# Altium schematic sheet stm32f103.SchDoc
size 381 x 203 mm; SheetNumber: 4; SheetTotal: 4
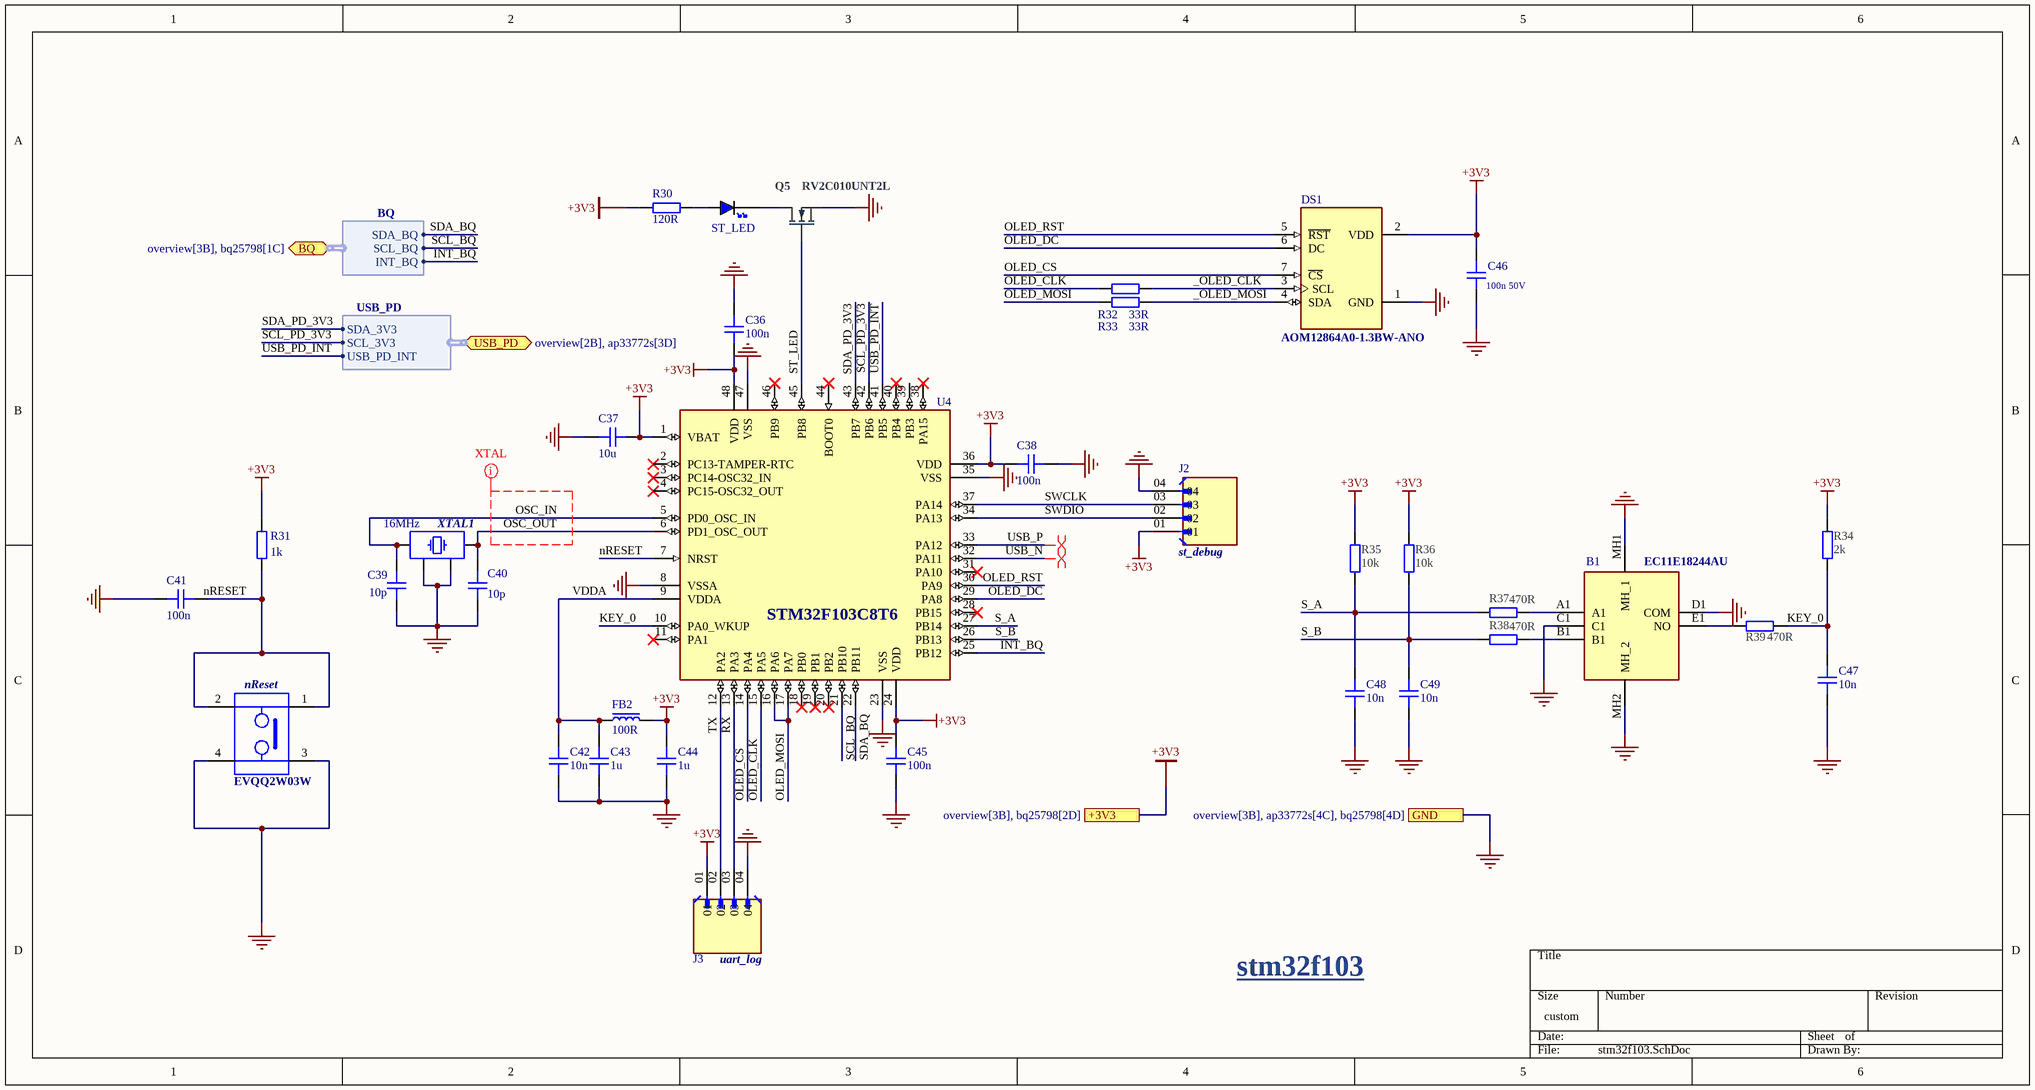
[diagram p0: stm32f103.SchDoc]

## Parts
B1  EC11E18244AU  [EC11E18244AU]
C36  100n  [CAP_0402]
C37  10u  [CAP_0402]
C38  100n  [CAP_0402]
C39  10p  [CAP_0402]
C40  10p  [CAP_0402]
C41  100n  [CAP_0603]
C42  10n  [CAP_0603]
C43  1u  [CAP_0603]
C44  1u  [CAP_0603]
C45  100n  [CAP_0402]
C46  100n 50V  [CAP_0603]
C47  10n  [CAP_0402]
C48  10n  [CAP_0402]
C49  10n  [CAP_0402]
DS1  AOM12864A0-1.3BW-ANO  [LCD_AOM12864A0-1.3BW-ANO]
FB2  100R  [FB_0603]
J2  st_debug  [SAMTEC_TSW-104-08-T-S-LL]
J3  uart_log  [SAMTEC_TSW-104-08-T-S-LL]
nReset  EVQQ2W03W  [EVQQ2W03W]
Q5  RV2C010UNT2L  [DFN65P100X40-3L]
R30  120R  [RES_0603]
R31  1k  [RES_0603]
R32  33R  [RES_0603]
R33  33R  [RES_0603]
R34  2k  [RESC1005X04L]
R35  10k  [RESC1005X04L]
R36  10k  [RESC1005X04L]
R37  470R  [RESC1005X04L]
R38  470R  [RESC1005X04L]
R39  470R  [RESC1005X04L]
ST_LED  BLUE  [LED_0603_BLUE]  (value not drawn)
U4  STM32F103C8T6  [QFP50P900X900X160-48N]
XTAL1  16MHz  [XTAL_2520]

## Ports
+3V3 (see overview[3B], bq25798[2D]), BQ (bidir, harness BQ, see overview[3B], bq25798[1C]), GND (see overview[3B], ap33772s[4C], bq25798[4D]), USB_PD (bidir, harness USB_PD, see overview[2B], ap33772s[3D])

## Harnesses
USB_PD: SCL_3V3, SDA_3V3, USB_PD_INT
BQ: SDA_BQ, SCL_BQ, INT_BQ

## Nets
+3V3: C36.2 C37.2 C38.1 C44.2 C45.2 C46.2 DS1.2(VDD) FB2.2 J2.01 J3.01 R30.2 R31.1 R34.2 R35.2 R36.2 U4.1(VBAT) U4.24(VDD) U4.36(VDD) U4.48(VDD) ; port +3V3
GND: B1.C1 B1.D1(COM) B1.MH1(MH_1) B1.MH2(MH_2) C36.1 C37.1 C38.2 C39.1 C40.1 C41.1 C42.1 C43.1 C44.1 C45.1 C46.1 C47.1 C48.1 C49.1 DS1.1(GND) J2.04 J3.04 nReset.3 nReset.4 Q5.2(S) U4.8(VSSA) U4.23(VSS) U4.35(VSS) U4.47(VSS) XTAL1.2 XTAL1.4 ; port GND
_OLED_CLK: DS1.3(SCL) R32.2
_OLED_MOSI: DS1.4(SDA) R33.2
INT_BQ: U4.25(PB12) ; port BQ.INT_BQ
KEY_0: C47.2 R34.1 R39.2 U4.10(PA0_WKUP)
nRESET: C41.2 nReset.1 nReset.2 R31.2 U4.7(NRST)
OLED_CLK: R32.1 U4.15(PA5)
OLED_CS: DS1.7(~{CS}) U4.14(PA4)
OLED_DC: DS1.6(DC) U4.29(PA8)
OLED_MOSI: R33.1 U4.16(PA6) U4.17(PA7)
OLED_RST: DS1.5(~{RST}) U4.30(PA9)
OSC_IN: C39.2 U4.5(PD0_OSC_IN) XTAL1.3
OSC_OUT: C40.2 U4.6(PD1_OSC_OUT) XTAL1.1
RX: J3.03 U4.13(PA3)
S_A: C48.2 R35.1 R37.1 U4.27(PB14)
S_B: C49.2 R36.1 R38.1 U4.26(PB13)
SCL_BQ: U4.21(PB10) ; port BQ.SCL_BQ
SCL_PD_3V3: U4.42(PB6) ; port USB_PD.SCL_3V3
SDA_BQ: U4.22(PB11) ; port BQ.SDA_BQ
SDA_PD_3V3: U4.43(PB7) ; port USB_PD.SDA_3V3
ST_LED: Q5.1(G) U4.45(PB8)
SWCLK: J2.03 U4.37(PA14)
SWDIO: J2.02 U4.34(PA13)
TX: J3.02 U4.12(PA2)
USB_N: U4.32(PA11)
USB_P: U4.33(PA12)
USB_PD_INT: U4.41(PB5) ; port USB_PD.USB_PD_INT
VDDA: C42.2 C43.2 FB2.1 U4.9(VDDA)
NetB1_A1: B1.A1 R37.2
NetB1_B1: B1.B1 R38.2
NetB1_E1: B1.E1(NO) R39.1
NetQ5_3: Q5.3(D) ST_LED.K
NetR30_1: R30.1 ST_LED.A

Not connected (* = marked no-connect by the designer): U4 2(PC13-TAMPER-RTC)* 3(PC14-OSC32_IN)* 4(PC15-OSC32_OUT)* 11(PA1)* 18(PB0)* 19(PB1)* 20(PB2)* 28(PB15)* 31(PA10)* 38(PA15)* 39(PB3) 40(PB4)* 44(BOOT0)* 46(PB9)*

## Layout directives
mark named XTAL: OSC_IN, OSC_OUT
differential pair: USB_N, USB_P

## Notes on the sheet
- stm32f103

## Library data of the parts
B1 = EC11E18244AU: Alps 18 Pulse Incremental Mechanical Rotary Encoder with a 6 mm Flat Shaft (Not Indexed), Through Hole 10mA 5V DC; Manufacturer_Name: ALPS Electric; Geometry.Height: 24.5mm; Mouser Part Number: 688-EC11E18244AU; Mouser Price/Stock: https://www.mouser.co.uk/ProductDetail/Alps-Alpine/EC11E18244AU?qs=YMSFtX0bdJDrS4vspzwcPg%3D%3D; Manufacturer_Part_Number: EC11E18244AU; Datasheet Link: https://tech.alpsalpine.com/cms.media/product_catalog_ec_01_ec11e_en_611f078659.pdf
C36-C40 C45 C47-C49 = CAP_0402: Capacitor SMD 0402; Manufacturer: *; Manufacturer Part Number: *; Distributor Link: *; LCSC: *; Rating: *; Dielectric: *
C41-C44 C46 = CAP_0603: Capacitor SMD 0603; Manufacturer: *; Manufacturer Part Number: *; Distributor Link: *; LCSC: *; Rating: *; Dielectric: *
DS1 = AOM12864A0-1.3BW-ANO: Non-Touch Graphic LCD Display Module - Blue OLED SPI 1.3 (33.02mm) 128 x 64; MF: Orient Display; SnapEDA_Link: https://www.snapeda.com/parts/AOM12864A0-1.3BW-ANO/Orient+Display/view-part/?ref=snap; Package: None; Value: *; MP: AOM12864A0-1.3BW-ANO; Check_prices: https://www.snapeda.com/parts/AOM12864A0-1.3BW-ANO/Orient+Display/view-part/?ref=eda
FB2 = FB_0603: Ferrite Bead SMD 0603; Manufacturer: *; Manufacturer Part Number: *; Distributor Link: *; LCSC: *
J2 J3 = 4PIN_TSW-104-08-T-S-LL: MF: Samtec; Availability: Unavailable; Value: *; Package: None; Price: None; MP: TSW-104-08-T-S-LL
nReset = EVQQ2W03W: White Push Plate Tactile Switch, SPST-NO 20 mA 3.1mm; MF: Panasonic; Package: None; Check_prices: https://www.snapeda.com/parts/EVQQ2W03W/Panasonic/view-part/?ref=eda; SnapEDA_Link: https://www.snapeda.com/parts/EVQQ2W03W/Panasonic/view-part/?ref=snap; Price: None; Availability: In Stock; MP: EVQQ2W03W; Value: *
Q5 = RV2C010UNT2L: N-Channel MOSFET, 20V, 1A, 470mOhm, 400mW; Manufacturer: Rohm Semiconductor; Part number IPS: 00000009976; Part number Norautron: 26320026; Part number NEMS: 101300132; Note: N.A.; Artikkelnr Noca: 35010020; Pad Count: 3; Component Status: Active; Part Number: RV2C010UNT2L; Manufacturer Part Number: RV2C010UNT2L; ComponentLink1URL: N.A.; ComponentLink1Description: Datasheet; ComponentLink2URL: N.A.; ComponentLink2Description: Supplier link; HelpURL: http://rohmfs.rohm.com/en/products/databook/datasheet/discrete/transistor/mosfet/rv2c010unt2l-e.pdf; Footprint Doc: DFN-3; LatestRevisionDate: 2016-08-09; Published: 2016-08-09; Value: RV2C010UNT2L; Supplier 1: Digi-Key; Supplier Part Number 1: RV2C010UNT2LCT-ND; Supplier 2: Mouser; Supplier Part Number 2: 755-RV2C010UNT2L; PartId: 101300132; Component Class: Semiconductors; Author: rsk
R30-R33 = RES_0603: Resistor SMD 0603; Manufacturer: *; Manufacturer Part Number: *; Distributor Link: *; LCSC: *
R34-R39 = R0402-0R: Resistor, ±5%, 0.063W; Manufacturer: N.A.; Part number IPS: 00000007128; Part number NEMS: 100100109; Value: 0R; Note: Chip Res 5%; Artikkelnr Noca: 27049000; Pad Count: 2; Component Status: Active; Part Number: R0402-0R; Manufacturer Part Number: N.A.; ComponentLink1URL: N.A.; ComponentLink1Description: Datasheet; ComponentLink2URL: N.A.; ComponentLink2Description: Supplier link; HelpURL: N.A.; Footprint Doc: 0402; LatestRevisionDate: 2009-11-23; Published: 2009-05-08; Supplier 1: Farnell; Supplier Part Number 1: 146-9661; Supplier 2: N.A.; Supplier Part Number 2: N.A.; PartId: 100100109; Component Class: Resistors; Author: rsk; Part number Norautron: N.A.
ST_LED = LED_0603_BLUE: LED 0603 BLUE SMD
U4 = STM32F103C8T6: ARMÂ® CortexÂ®-M3 STM32F1 Microcontroller IC 32-Bit 72MHz 64KB (64K x 8) FLASH 48-LQFP (7x7); MF: STMicroelectronics; Package: LQFP-48 STMicroelectronics; Price: None; Check_prices: https://www.snapeda.com/parts/STM32F103C8T6/STMicroelectronics/view-part/?ref=eda; Value: *; SnapEDA_Link: https://www.snapeda.com/parts/STM32F103C8T6/STMicroelectronics/view-part/?ref=snap; MP: STM32F103C8T6; Availability: In Stock; Purchase-URL: https://pricing.snapeda.com/search/part/STM32F103C8T6/?ref=eda
XTAL1 = XTAL_2520: Crystal SMD 2520; Distributor Link: *